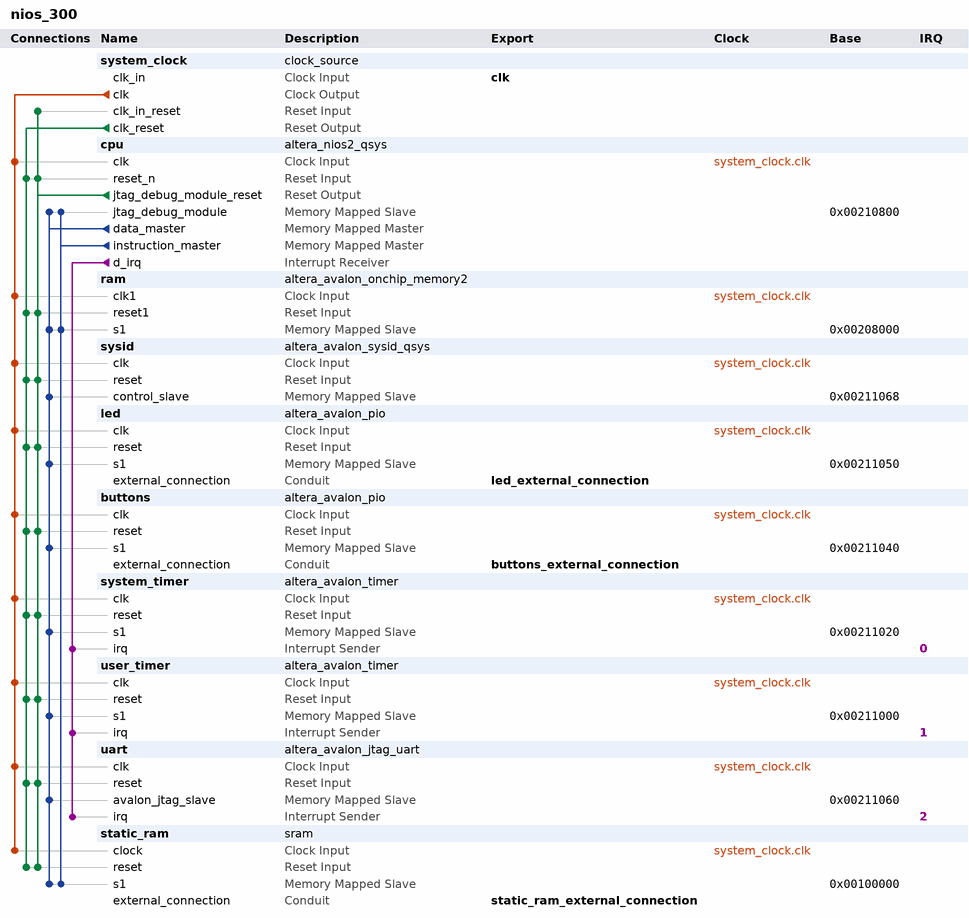
[diagram p0: system contents]
# Platform Designer (Qsys) system nios_300, Cyclone IV E EP4CE22F17C6
# Parameters at their usual value, and those the tool derives, are not listed.
package require -exact qsys 13.0.1.99.2
create_system nios_300
set_project_property DEVICE_FAMILY {Cyclone IV E}
set_project_property DEVICE EP4CE22F17C6

add_instance system_clock clock_source 13.0
set_instance_parameter_value system_clock clockFrequency 50000000

add_instance cpu altera_nios2_qsys 13.0
set_instance_parameter_value cpu resetSlave ram.s1
set_instance_parameter_value cpu mmu_TLBMissExcSlave None
set_instance_parameter_value cpu exceptionSlave ram.s1
set_instance_parameter_value cpu breakSlave cpu.jtag_debug_module
set_instance_parameter_value cpu impl Tiny
set_instance_parameter_value cpu icache_size 4096

add_instance ram altera_avalon_onchip_memory2 13.0.1.99.2
set_instance_parameter_value ram dataWidth 32
set_instance_parameter_value ram dualPort false
set_instance_parameter_value ram initMemContent true
set_instance_parameter_value ram initializationFileName onchip_mem.hex
set_instance_parameter_value ram memorySize 32768

add_instance sysid altera_avalon_sysid_qsys 13.0
set_instance_parameter_value sysid id 221440

add_instance led altera_avalon_pio 13.0.1.99.2
set_instance_parameter_value led direction Output
set_instance_parameter_value led width 8

add_instance buttons altera_avalon_pio 13.0.1.99.2
set_instance_parameter_value buttons direction Output
set_instance_parameter_value buttons width 2

add_instance system_timer altera_avalon_timer 13.0.1.99.2
set_instance_parameter_value system_timer period 1
set_instance_parameter_value system_timer periodUnits MSEC

add_instance user_timer altera_avalon_timer 13.0.1.99.2
set_instance_parameter_value user_timer period 500
set_instance_parameter_value user_timer periodUnits MSEC

add_instance uart altera_avalon_jtag_uart 13.0.1.99.2
set_instance_parameter_value uart simInteractiveOptions NO_INTERACTIVE_WINDOWS

add_instance static_ram sram 1.2

# connections
add_connection system_clock.clk buttons.clk clock
add_connection system_clock.clk cpu.clk clock
add_connection system_clock.clk led.clk clock
add_connection system_clock.clk ram.clk1 clock
add_connection system_clock.clk static_ram.clock clock
add_connection system_clock.clk sysid.clk clock
add_connection system_clock.clk system_timer.clk clock
add_connection system_clock.clk uart.clk clock
add_connection system_clock.clk user_timer.clk clock
add_connection cpu.jtag_debug_module_reset buttons.reset reset
add_connection cpu.jtag_debug_module_reset cpu.reset_n reset
add_connection cpu.jtag_debug_module_reset led.reset reset
add_connection cpu.jtag_debug_module_reset ram.reset1 reset
add_connection cpu.jtag_debug_module_reset static_ram.reset reset
add_connection cpu.jtag_debug_module_reset sysid.reset reset
add_connection cpu.jtag_debug_module_reset system_clock.clk_in_reset reset
add_connection cpu.jtag_debug_module_reset system_timer.reset reset
add_connection cpu.jtag_debug_module_reset uart.reset reset
add_connection cpu.jtag_debug_module_reset user_timer.reset reset
add_connection system_clock.clk_reset buttons.reset reset
add_connection system_clock.clk_reset cpu.reset_n reset
add_connection system_clock.clk_reset led.reset reset
add_connection system_clock.clk_reset ram.reset1 reset
add_connection system_clock.clk_reset static_ram.reset reset
add_connection system_clock.clk_reset sysid.reset reset
add_connection system_clock.clk_reset system_timer.reset reset
add_connection system_clock.clk_reset uart.reset reset
add_connection system_clock.clk_reset user_timer.reset reset
add_connection cpu.data_master buttons.s1 avalon
set_connection_parameter_value cpu.data_master/buttons.s1 baseAddress 0x00211040
add_connection cpu.data_master cpu.jtag_debug_module avalon
set_connection_parameter_value cpu.data_master/cpu.jtag_debug_module baseAddress 0x00210800
add_connection cpu.data_master led.s1 avalon
set_connection_parameter_value cpu.data_master/led.s1 baseAddress 0x00211050
add_connection cpu.data_master ram.s1 avalon
set_connection_parameter_value cpu.data_master/ram.s1 baseAddress 0x00208000
add_connection cpu.data_master static_ram.s1 avalon
set_connection_parameter_value cpu.data_master/static_ram.s1 baseAddress 0x00100000
add_connection cpu.data_master sysid.control_slave avalon
set_connection_parameter_value cpu.data_master/sysid.control_slave baseAddress 0x00211068
add_connection cpu.data_master system_timer.s1 avalon
set_connection_parameter_value cpu.data_master/system_timer.s1 baseAddress 0x00211020
add_connection cpu.data_master uart.avalon_jtag_slave avalon
set_connection_parameter_value cpu.data_master/uart.avalon_jtag_slave baseAddress 0x00211060
add_connection cpu.data_master user_timer.s1 avalon
set_connection_parameter_value cpu.data_master/user_timer.s1 baseAddress 0x00211000
add_connection cpu.instruction_master cpu.jtag_debug_module avalon
set_connection_parameter_value cpu.instruction_master/cpu.jtag_debug_module baseAddress 0x00210800
add_connection cpu.instruction_master ram.s1 avalon
set_connection_parameter_value cpu.instruction_master/ram.s1 baseAddress 0x00208000
add_connection cpu.instruction_master static_ram.s1 avalon
set_connection_parameter_value cpu.instruction_master/static_ram.s1 baseAddress 0x00100000
add_connection cpu.d_irq system_timer.irq interrupt
set_connection_parameter_value cpu.d_irq/system_timer.irq irqNumber 0
add_connection cpu.d_irq uart.irq interrupt
set_connection_parameter_value cpu.d_irq/uart.irq irqNumber 2
add_connection cpu.d_irq user_timer.irq interrupt
set_connection_parameter_value cpu.d_irq/user_timer.irq irqNumber 1

# exported interfaces
add_interface clk clock sink
set_interface_property clk EXPORT_OF system_clock.clk_in
add_interface buttons_external_connection conduit end
set_interface_property buttons_external_connection EXPORT_OF buttons.external_connection
add_interface led_external_connection conduit end
set_interface_property led_external_connection EXPORT_OF led.external_connection
add_interface static_ram_external_connection conduit end
set_interface_property static_ram_external_connection EXPORT_OF static_ram.external_connection

set_interconnect_requirement {$system} qsys_mm.clockCrossingAdapter HANDSHAKE
set_interconnect_requirement {$system} qsys_mm.maxAdditionalLatency 1

save_system nios_300.qsys
